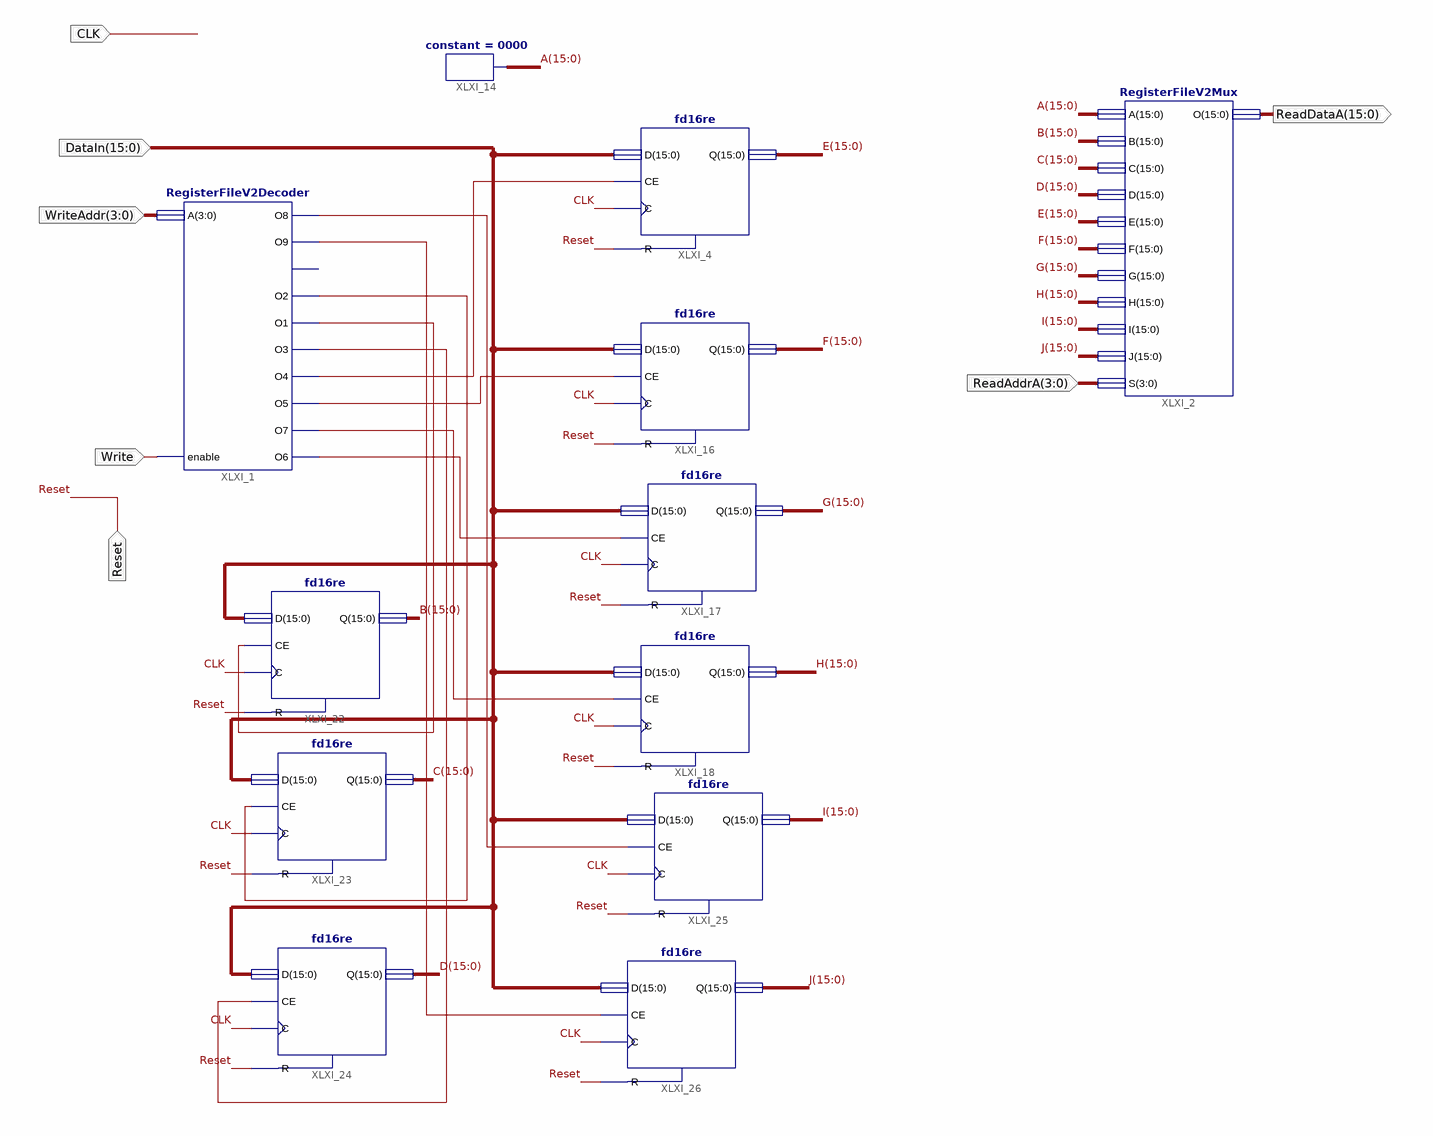
[diagram p0: schematic sheet 1]
// Xilinx ISE schematic RegisterFileV2.sch (spartan3a) as structural Verilog: 12 symbols, 7 ports
module RegisterFileV2 (
  input  Write,
  input  [3:0] WriteAddr,
  input  CLK,
  input  [15:0] DataIn,
  input  Reset,
  input  [3:0] ReadAddrA,
  output [15:0] ReadDataA
);

  wire XLXN_161, XLXN_162, XLXN_163, XLXN_164, XLXN_165, XLXN_166, XLXN_167, XLXN_168, XLXN_169;
  wire [15:0] A, B, C, D, E, F, G, H, I, J;

  RegisterFileV2Decoder XLXI_1 (
    .A(WriteAddr), .enable(Write), .O8(XLXN_168), .O9(XLXN_169), .O2(XLXN_162), .O1(XLXN_161), .O3(XLXN_163),
    .O4(XLXN_164), .O5(XLXN_165), .O7(XLXN_167), .O6(XLXN_166));  // open: O0
  RegisterFileV2Mux XLXI_2 (
    .A(A), .B(B), .C(C), .D(D), .E(E), .F(F), .G(G), .H(H), .I(I), .J(J), .S(ReadAddrA), .O(ReadDataA));
  fd16re XLXI_4 (.C(CLK), .CE(XLXN_164), .D(DataIn), .R(Reset), .Q(E));
  constant #(.CValue("0000")) XLXI_14 (.O(A));
  fd16re XLXI_16 (.C(CLK), .CE(XLXN_165), .D(DataIn), .R(Reset), .Q(F));
  fd16re XLXI_17 (.C(CLK), .CE(XLXN_166), .D(DataIn), .R(Reset), .Q(G));
  fd16re XLXI_22 (.C(CLK), .CE(XLXN_161), .D(DataIn), .R(Reset), .Q(B));
  fd16re XLXI_23 (.C(CLK), .CE(XLXN_162), .D(DataIn), .R(Reset), .Q(C));
  fd16re XLXI_24 (.C(CLK), .CE(XLXN_163), .D(DataIn), .R(Reset), .Q(D));
  fd16re XLXI_18 (.C(CLK), .CE(XLXN_167), .D(DataIn), .R(Reset), .Q(H));
  fd16re XLXI_25 (.C(CLK), .CE(XLXN_168), .D(DataIn), .R(Reset), .Q(I));
  fd16re XLXI_26 (.C(CLK), .CE(XLXN_169), .D(DataIn), .R(Reset), .Q(J));
endmodule
